# EAGLE design atmega embedded main - za drugog Marka (EAGLE 9.5.1)
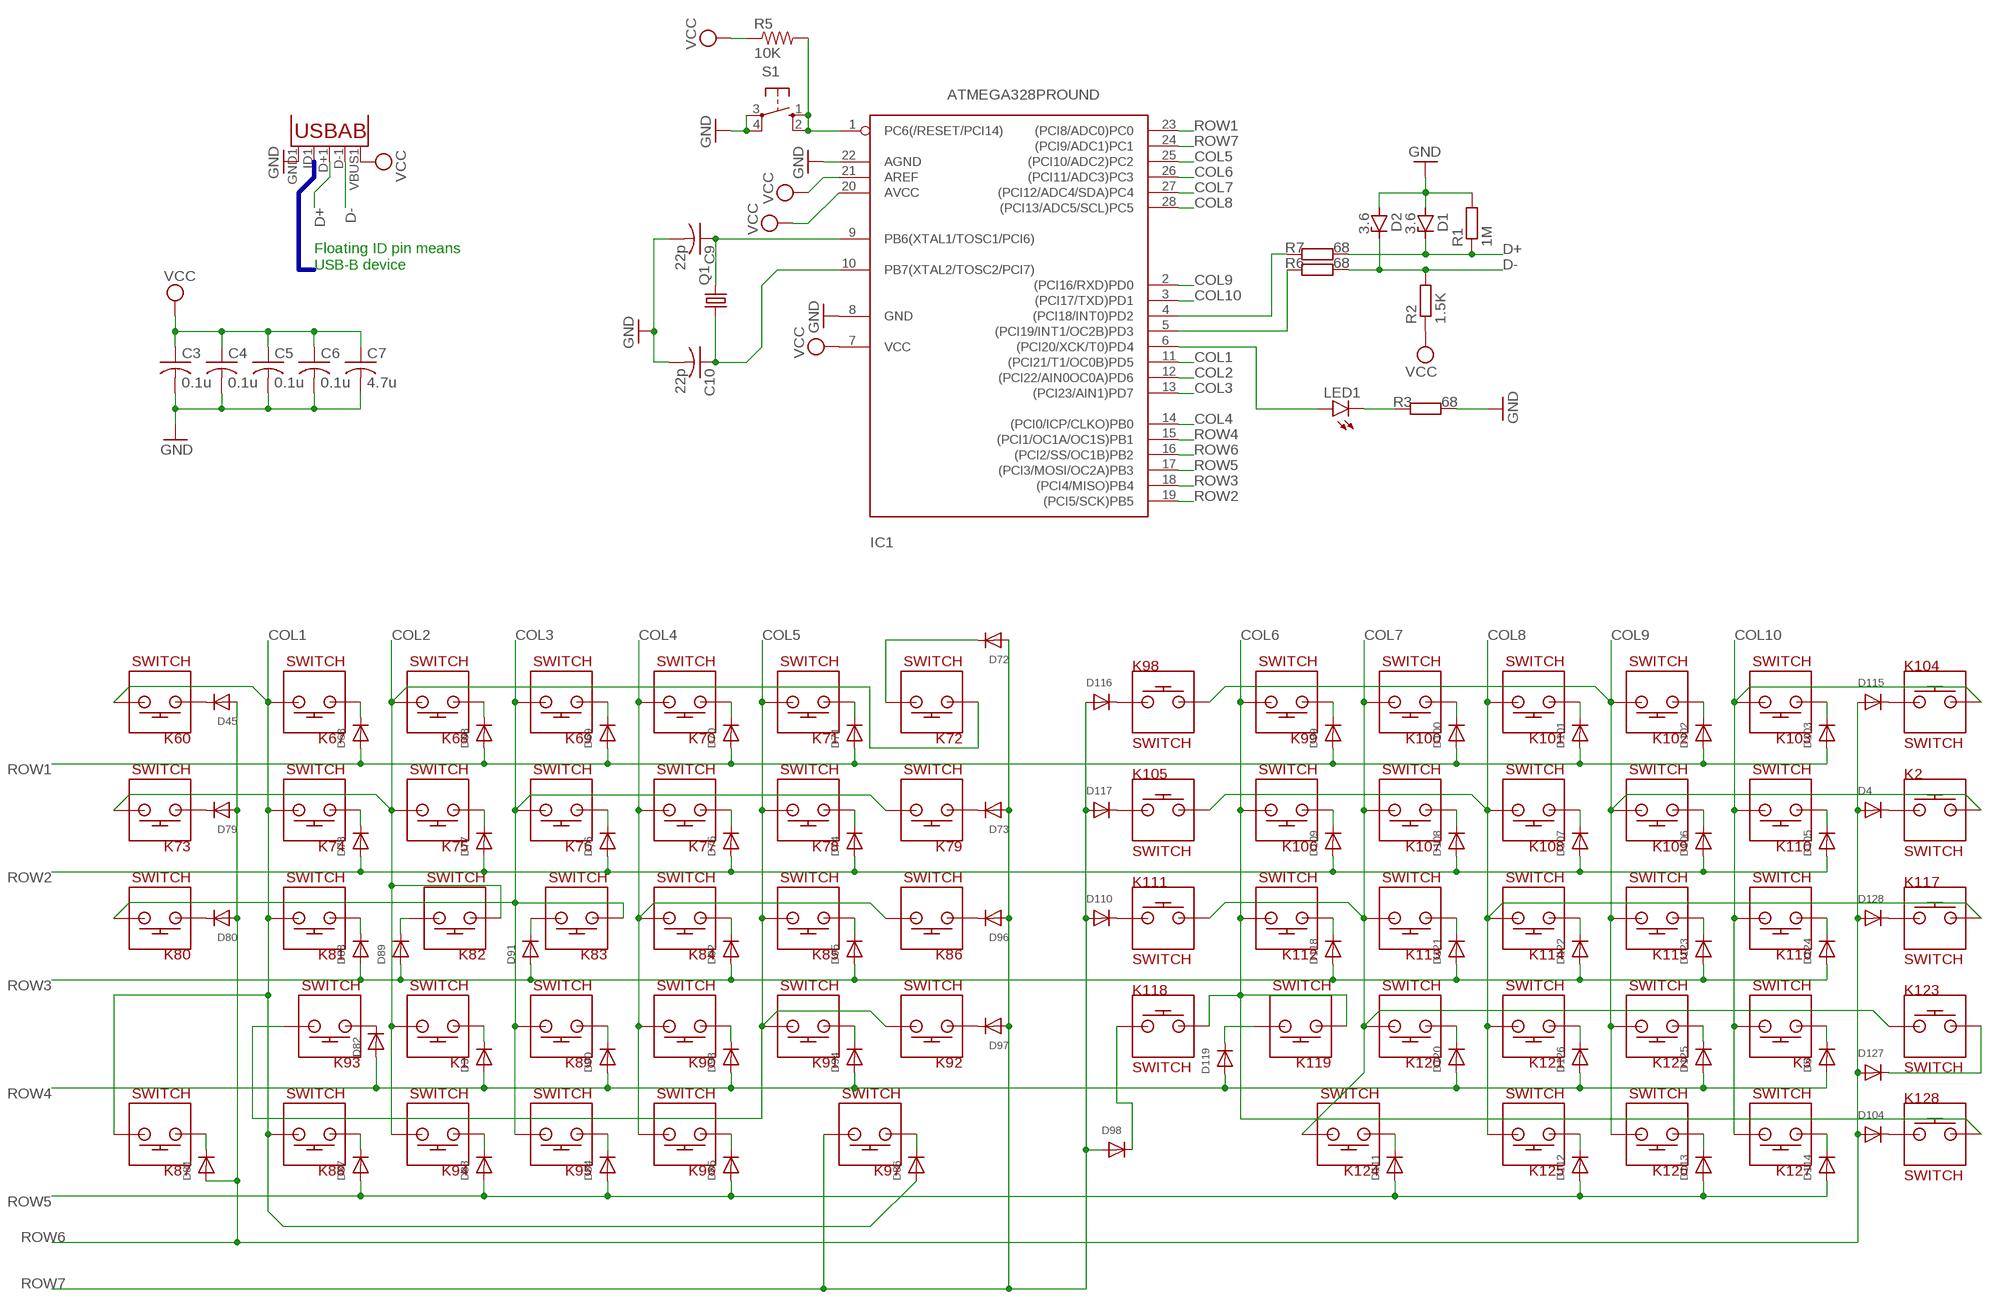
[diagram p0: schematic, sheet 1]

## Parts
C3  0.1u  C-USC0805  [C0805]
C4  0.1u  C-USC0805  [C0805]
C5  0.1u  C-USC0805  [C0805]
C6  0.1u  C-USC0805  [C0805]
C7  4.7u  C-USC0805  [C0805]
C9  22p  C-USC0805  [C0805]
C10  22p  C-USC0805  [C0805]
D1  3.6  ZENER-DIODESMB  [SMB]
D2  3.6  ZENER-DIODESMB  [SMB]
D3  DIODESMA  [SMADIODE]
D4  DIODESMA  [SMADIODE]
D5  DIODESMA  [SMADIODE]
D45  DIODESMA  [SMADIODE]
D63  DIODESMA  [SMADIODE]
D68  DIODESMA  [SMADIODE]
D69  DIODESMA  [SMADIODE]
D70  DIODESMA  [SMADIODE]
D71  DIODESMA  [SMADIODE]
D72  DIODESMA  [SMADIODE]
D73  DIODESMA  [SMADIODE]
D74  DIODESMA  [SMADIODE]
D75  DIODESMA  [SMADIODE]
D76  DIODESMA  [SMADIODE]
D77  DIODESMA  [SMADIODE]
D78  DIODESMA  [SMADIODE]
D79  DIODESMA  [SMADIODE]
D80  DIODESMA  [SMADIODE]
D81  DIODESMA  [SMADIODE]
D82  DIODESMA  [SMADIODE]
D83  DIODESMA  [SMADIODE]
D84  DIODESMA  [SMADIODE]
D85  DIODESMA  [SMADIODE]
D86  DIODESMA  [SMADIODE]
D87  DIODESMA  [SMADIODE]
D88  DIODESMA  [SMADIODE]
D89  DIODESMA  [SMADIODE]
D90  DIODESMA  [SMADIODE]
D91  DIODESMA  [SMADIODE]
D92  DIODESMA  [SMADIODE]
D93  DIODESMA  [SMADIODE]
D94  DIODESMA  [SMADIODE]
D95  DIODESMA  [SMADIODE]
D96  DIODESMA  [SMADIODE]
D97  DIODESMA  [SMADIODE]
D98  DIODESMA  [SMADIODE]
D99  DIODESMA  [SMADIODE]
D100  DIODESMA  [SMADIODE]
D101  DIODESMA  [SMADIODE]
D102  DIODESMA  [SMADIODE]
D103  DIODESMA  [SMADIODE]
D104  DIODESMA  [SMADIODE]
D105  DIODESMA  [SMADIODE]
D106  DIODESMA  [SMADIODE]
D107  DIODESMA  [SMADIODE]
D108  DIODESMA  [SMADIODE]
D109  DIODESMA  [SMADIODE]
D110  DIODESMA  [SMADIODE]
D111  DIODESMA  [SMADIODE]
D112  DIODESMA  [SMADIODE]
D113  DIODESMA  [SMADIODE]
D114  DIODESMA  [SMADIODE]
D115  DIODESMA  [SMADIODE]
D116  DIODESMA  [SMADIODE]
D117  DIODESMA  [SMADIODE]
D118  DIODESMA  [SMADIODE]
D119  DIODESMA  [SMADIODE]
D120  DIODESMA  [SMADIODE]
D121  DIODESMA  [SMADIODE]
D122  DIODESMA  [SMADIODE]
D123  DIODESMA  [SMADIODE]
D124  DIODESMA  [SMADIODE]
D125  DIODESMA  [SMADIODE]
D126  DIODESMA  [SMADIODE]
D127  DIODESMA  [SMADIODE]
D128  DIODESMA  [SMADIODE]
IC1  ATMEGA328PROUND  [DIL28-3-ROUND]
K1  SWITCH  [KAILH_LOW_PROFILE]
K2  SWITCH  [KAILH_LOW_PROFILE]
K3  SWITCH  [KAILH_LOW_PROFILE]
K60  SWITCH  [KAILH_LOW_PROFILE]
K67  SWITCH  [KAILH_LOW_PROFILE]
K68  SWITCH  [KAILH_LOW_PROFILE]
K69  SWITCH  [KAILH_LOW_PROFILE]
K70  SWITCH  [KAILH_LOW_PROFILE]
K71  SWITCH  [KAILH_LOW_PROFILE]
K72  SWITCH  [KAILH_LOW_PROFILE]
K73  SWITCH  [KAILH_LOW_PROFILE]
K74  SWITCH  [KAILH_LOW_PROFILE]
K75  SWITCH  [KAILH_LOW_PROFILE]
K76  SWITCH  [KAILH_LOW_PROFILE]
K77  SWITCH  [KAILH_LOW_PROFILE]
K78  SWITCH  [KAILH_LOW_PROFILE]
K79  SWITCH  [KAILH_LOW_PROFILE]
K80  SWITCH  [KAILH_LOW_PROFILE]
K81  SWITCH  [KAILH_LOW_PROFILE]
K82  SWITCH  [KAILH_LOW_PROFILE]
K83  SWITCH  [KAILH_LOW_PROFILE]
K84  SWITCH  [KAILH_LOW_PROFILE]
K85  SWITCH  [KAILH_LOW_PROFILE]
K86  SWITCH  [KAILH_LOW_PROFILE]
K87  SWITCH  [KAILH_LOW_PROFILE]
K88  SWITCH  [KAILH_LOW_PROFILE]
K89  SWITCH  [KAILH_LOW_PROFILE]
K90  SWITCH  [KAILH_LOW_PROFILE]
K91  SWITCH  [KAILH_LOW_PROFILE]
K92  SWITCH  [KAILH_LOW_PROFILE]
K93  SWITCH  [KAILH_LOW_PROFILE]
K94  SWITCH  [KAILH_LOW_PROFILE]
K95  SWITCH  [KAILH_LOW_PROFILE]
K96  SWITCH  [KAILH_LOW_PROFILE]
K97  SWITCH  [KAILH_LOW_PROFILE]
K98  SWITCH  [KAILH_LOW_PROFILE]
K99  SWITCH  [KAILH_LOW_PROFILE]
K100  SWITCH  [KAILH_LOW_PROFILE]
K101  SWITCH  [KAILH_LOW_PROFILE]
K102  SWITCH  [KAILH_LOW_PROFILE]
K103  SWITCH  [KAILH_LOW_PROFILE]
K104  SWITCH  [KAILH_LOW_PROFILE]
K105  SWITCH  [KAILH_LOW_PROFILE]
K106  SWITCH  [KAILH_LOW_PROFILE]
K107  SWITCH  [KAILH_LOW_PROFILE]
K108  SWITCH  [KAILH_LOW_PROFILE]
K109  SWITCH  [KAILH_LOW_PROFILE]
K110  SWITCH  [KAILH_LOW_PROFILE]
K111  SWITCH  [KAILH_LOW_PROFILE]
K112  SWITCH  [KAILH_LOW_PROFILE]
K113  SWITCH  [KAILH_LOW_PROFILE]
K114  SWITCH  [KAILH_LOW_PROFILE]
K115  SWITCH  [KAILH_LOW_PROFILE]
K116  SWITCH  [KAILH_LOW_PROFILE]
K117  SWITCH  [KAILH_LOW_PROFILE]
K118  SWITCH  [KAILH_LOW_PROFILE]
K119  SWITCH  [KAILH_LOW_PROFILE]
K120  SWITCH  [KAILH_LOW_PROFILE]
K121  SWITCH  [KAILH_LOW_PROFILE]
K122  SWITCH  [KAILH_LOW_PROFILE]
K123  SWITCH  [KAILH_LOW_PROFILE]
K124  SWITCH  [KAILH_LOW_PROFILE]
K125  SWITCH  [KAILH_LOW_PROFILE]
K126  SWITCH  [KAILH_LOW_PROFILE]
K127  SWITCH  [KAILH_LOW_PROFILE]
K128  SWITCH  [KAILH_LOW_PROFILE]
LED1  LEDCHIPLED_1206  [CHIPLED_1206]
Q1  CRYSTALHC49S  [HC49/S]
R1  1M  RR1206  [R1206]
R2  1.5K  RR1206  [R1206]
R3  68  RR1206  [R1206]
R5  10K  R-US_M0805  [M0805]
R6  68  RR1206  [R1206]
R7  68  RR1206  [R1206]
S1  10-XX  [B3F-10XX]
U1  USB""  [USB-MICRO-SMD]

## Nets
COL1: D86.A IC1.11((PCI21/T1/OC0B)PD5) K60.P$2 K67.P$2 K74.P$2 K81.P$2 K87.P$2 K88.P$2
COL2: IC1.12((PCI22/AIN0OC0A)PD6) K1.P$2 K68.P$2 K72.P$1 K73.P$2 K75.P$2 K82.P$1 K94.P$2
COL3: IC1.13((PCI23/AIN1)PD7) K69.P$2 K76.P$2 K79.P$2 K80.P$2 K83.P$1 K89.P$2 K95.P$2
COL4: IC1.14((PCI0/ICP/CLKO)PB0) K70.P$2 K77.P$2 K84.P$2 K86.P$2 K90.P$2 K96.P$2
COL5: IC1.25((PCI10/ADC2)PC2) K71.P$2 K78.P$2 K85.P$2 K91.P$2 K92.P$2 K93.P$2
COL6: IC1.26((PCI11/ADC3)PC3) K99.P$2 K106.P$2 K112.P$2 K118.P$2 K119.P$1 K128.P$2
COL7: IC1.27((PCI12/ADC4/SDA)PC4) K100.P$2 K107.P$2 K111.P$2 K113.P$2 K120.P$2 K123.P$1 K124.P$2
COL8: IC1.28((PCI13/ADC5/SCL)PC5) K101.P$2 K105.P$2 K108.P$2 K114.P$2 K117.P$2 K121.P$2 K125.P$2
COL9: IC1.2((PCI16/RXD)PD0) K2.P$2 K98.P$2 K102.P$2 K109.P$2 K115.P$2 K122.P$2 K126.P$2
COL10: IC1.3((PCI17/TXD)PD1) K3.P$2 K103.P$2 K104.P$2 K110.P$2 K116.P$2 K127.P$2
D+: D1.C R1.1 R7.2 U1.D+1(D+)
D-: D2.C R2.2 R6.2 U1.D-1(D-)
GND: C3.2 C4.2 C5.2 C6.2 C7.2 C9.2 C10.2 D1.A D2.A IC1.8(GND) IC1.22(AGND) R1.2 R3.2 S1.3(P) S1.4(P1) U1.GND1(GND)
N$1: D45.C K60.P$1
N$2: D79.C K73.P$1
N$3: D80.C K80.P$1
N$4: D81.C K87.P$1
N$5: D82.C K93.P$1
N$6: D63.C K67.P$1
N$7: D88.C K81.P$1
N$8: D78.C K74.P$1
N$9: D83.C K94.P$1
N$10: D77.C K75.P$1
N$11: D89.C K82.P$2
N$12: D68.C K68.P$1
N$13: D84.C K95.P$1
N$14: D76.C K76.P$1
N$15: D98.C K118.P$1
N$16: C9.1 IC1.9(PB6(XTAL1/TOSC1/PCI6)) Q1.2
N$17: C10.1 IC1.10(PB7(XTAL2/TOSC2/PCI7)) Q1.1
N$18: D69.C K69.P$1
N$19: D90.C K89.P$1
N$20: D85.C K96.P$1
N$21: IC1.4((PCI18/INT0)PD2) R7.1
N$22: D91.C K83.P$2
N$23: D86.C K97.P$1
N$24: D70.C K70.P$1
N$25: D75.C K77.P$1
N$26: D5.C K3.P$1
N$27: D116.C K98.P$1
N$28: D117.C K105.P$1
N$29: D92.C K84.P$1
N$30: D93.C K90.P$1
N$31: D94.C K91.P$1
N$32: D71.C K71.P$1
N$33: D74.C K78.P$1
N$34: D95.C K85.P$1
N$35: D4.C K2.P$1
N$36: D72.C K72.P$2
N$37: D73.C K79.P$1
N$38: D96.C K86.P$1
N$39: D97.C K92.P$1
N$40: D110.C K111.P$1
N$41: D119.C K119.P$2
N$42: D115.C K104.P$1
N$43: D127.C K123.P$2
N$44: D99.C K99.P$1
N$45: D109.C K106.P$1
N$46: D118.C K112.P$1
N$47: D111.C K124.P$1
N$48: D100.C K100.P$1
N$49: D108.C K107.P$1
N$50: D121.C K113.P$1
N$51: D120.C K120.P$1
N$52: D126.C K121.P$1
N$53: D101.C K101.P$1
N$54: D107.C K108.P$1
N$55: D122.C K114.P$1
N$56: D112.C K125.P$1
N$57: D123.C K115.P$1
N$58: D106.C K109.P$1
N$59: D102.C K102.P$1
N$60: D113.C K126.P$1
N$61: D124.C K116.P$1
N$62: D105.C K110.P$1
N$63: D103.C K103.P$1
N$64: D114.C K127.P$1
N$65: D128.C K117.P$1
N$67: D104.C K128.P$1
N$68: IC1.5((PCI19/INT1/OC2B)PD3) R6.1
N$69: IC1.6((PCI20/XCK/T0)PD4) LED1.A
N$70: LED1.C R3.1
N$71: D3.C K1.P$1
N$80: D87.C K88.P$1
N$142: D125.C K122.P$1
RESET: IC1.1(PC6(/RESET/PCI14)) R5.2 S1.1(S) S1.2(S1)
ROW1: D63.A D68.A D69.A D70.A D71.A D99.A D100.A D101.A D102.A D103.A IC1.23((PCI8/ADC0)PC0)
ROW2: D74.A D75.A D76.A D77.A D78.A D105.A D106.A D107.A D108.A D109.A IC1.19((PCI5/SCK)PB5)
ROW3: D88.A D89.A D91.A D92.A D95.A D118.A D121.A D122.A D123.A D124.A IC1.18((PCI4/MISO)PB4)
ROW4: D3.A D5.A D82.A D90.A D93.A D94.A D119.A D120.A D125.A D126.A IC1.15((PCI1/OC1A/OC1S)PB1)
ROW5: D83.A D84.A D85.A D87.A D111.A D112.A D113.A D114.A IC1.17((PCI3/MOSI/OC2A)PB3)
ROW6: D4.A D45.A D79.A D80.A D81.A D104.A D115.A D127.A D128.A IC1.16((PCI2/SS/OC1B)PB2)
ROW7: D72.A D73.A D96.A D97.A D98.A D110.A D116.A D117.A IC1.24((PCI9/ADC1)PC1) K97.P$2
VCC: C3.1 C4.1 C5.1 C6.1 C7.1 IC1.7(VCC) IC1.20(AVCC) IC1.21(AREF) R2.1 R5.1 U1.VBUS1(VBUS)
Unconnected: U1.ID1(USBID)

## Buses
B$1

## Notes on the sheet
- Floating ID pin means
  USB-B device

## Library data of the parts
C3-C7 C9 C10 = adafruit:C-US: CAPACITOR, American symbol
D1 D2 = diode:ZENER-DIODE: Z-Diode
D3-D5 D45 D63 D68-D128 = adafruit:DIODE: Diode SMADIODE - SMA Surface Mount Package 20V 1A Schottky Diode Digikey: 641-1014-6-ND DO-1N4148 - Through Hole Small Current Diode SOD-123 20V 1 A (.5mV Vf) Schottky Diode - Digikey: MBRX120TPMSCT-ND SOD-323 10V 570mA (.38mV Vf, 3ns) Schottky Diode - Digikey: ZLLS410CT-ND SOD-523 30V 30mA Schottky Diode (RB751S-40TE61) - Digikey: RB751S-40TE61CT-ND SOT23-R/W - SOT23 Package (R = Solder Paste/Reflow Ovens, W = Hand-Soldering) BAT54Film 40V 300mA - Digikey: 497-7162-1-ND
IC1 = atmega328:ATMEGA328*P: MICROCONTROLLER 32 kBytes FLASH 2 kBytes SRAM 1 kBytes EEPROM USART 8-channel 10 bit ADC
K1-K3 K60 K67-K128 = keyboard_switch:SWITCH
LED1 = led:LED: LED OSRAM: - CHIPLED LG R971, LG N971, LY N971, LG Q971, LY Q971, LO R971, LY R971 LH N974, LH R974 LS Q976, LO Q976, LY Q976 LO Q996 - Hyper CHIPLED LW Q18S LB Q993, LB Q99A, LB R99A - SideLED LS A670, LO A670, LY A670, LG A670, LP A670 LB A673, LV A673, LT A673, LW A673 LH A674 LY A675 LS A676, LA A676, LO A676, LY A676, LW A676 LS A679, LY A679, LG A679 - Hyper Micro SIDELED® LS Y876, LA Y876, LO Y876, LY Y876 LT Y87S - SmartLED LW L88C, LW L88S LB L89C, LB L89S, LG L890 LS L89K, LO L89K, LY L89K LS L896, LA L896, LO L896, LY L896 - TOPLED LS T670, LO T670, LY T670, LG T670, LP T670 LSG T670, LSP T670, LSY T670, LOP T670, LYG T670 LG T671, LOG T671, LSG T671 LB T673, LV T673, LT T673, LW T673 LH T674 LS T676, LA T676, LO T676, LY T676, LB T676, LH T676, LSB T676, LW T676 LB T67C, LV T67C, LT T67C, LS T67K, LO T67K, LY T67K, LW E67C LS E67B, LA E67B, LO E67B, LY E67B, LB E67C, LV E67C, LT E67C LW T67C LS T679, LY T679, LG T679 LS T770, LO T770, LY T770, LG T770, LP T770 LB T773, LV T773, LT T773, LW T773 LH T774 LS E675, LA E675, LY E675, LS T675 LS T776, LA T776, LO T776, LY T776, LB T776 LHGB T686 LT T68C, LB T68C - Hyper Mini TOPLED® LB M676 - Mini TOPLED Santana® LG M470 LS M47K, LO M47K, LY M47K Source: http://www.osram.convergy.de LUXEON: - LUMILED® LXK2-PW12-R00, LXK2-PW12-S00, LXK2-PW14-U00, LXK2-PW14-V00 LXK2-PM12-R00, LXK2-PM12-S00, LXK2-PM14-U00 LXK2-PE12-Q00, LXK2-PE12-R00, LXK2-PE12-S00, LXK2-PE14-T00, LXK2-PE14-U00 LXK2-PB12-K00, LXK2-PB12-L00, LXK2-PB12-M00, LXK2-PB14-N00, LXK2-PB14-P00, LXK2-PB14-Q00 LXK2-PR12-L00, LXK2-PR12-M00, LXK2-PR14-Q00, LXK2-PR14-R00 LXK2-PD12-Q00, LXK2-PD12-R00, LXK2-PD12-S00 LXK2-PH12-R00, LXK2-PH12-S00 LXK2-PL12-P00, LXK2-PL12-Q00, LXK2-PL12-R00 Source: www.luxeon.com KINGBRIGHT: KA-3528ASYC Source: www.kingbright.com
Q1 = crystal:CRYSTAL: CRYSTAL; OC_FARNELL: 1667008; OC_NEWARK: unknown
R1-R3 R6 R7 = eagle-ltspice:R: RESISTOR, European symbol; SPICEMODEL: NONE; SPICEPREFIX: R
R5 = adafruit:R-US_: RESISTOR, American symbol
S1 = switch-omron:10-XX: OMRON SWITCH; MPN: B3F-1000; OC_FARNELL: 176432; OC_NEWARK: 36M3542
U1 = microusb:USB: This is a USB AB connector that is compatible with USB OTG. i.e. this connector can serve as a host or device

## Net classes
0 default: width 2 mm, drill 2 mm

## Board
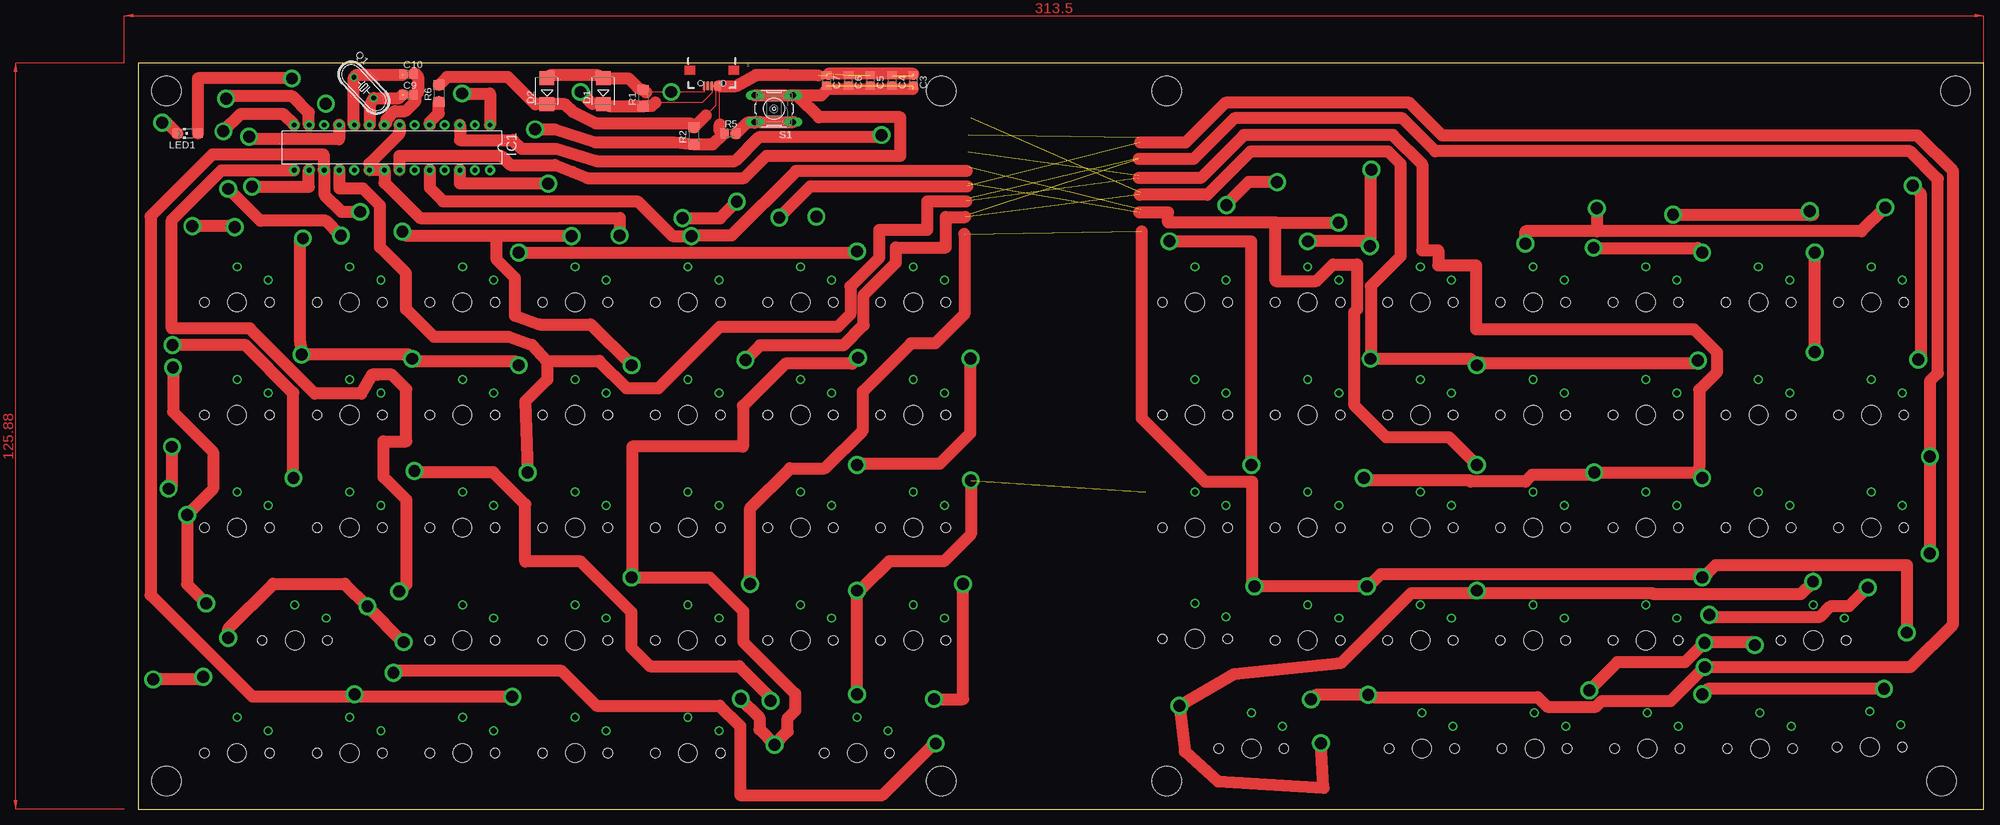
[diagram p1: board, top side]
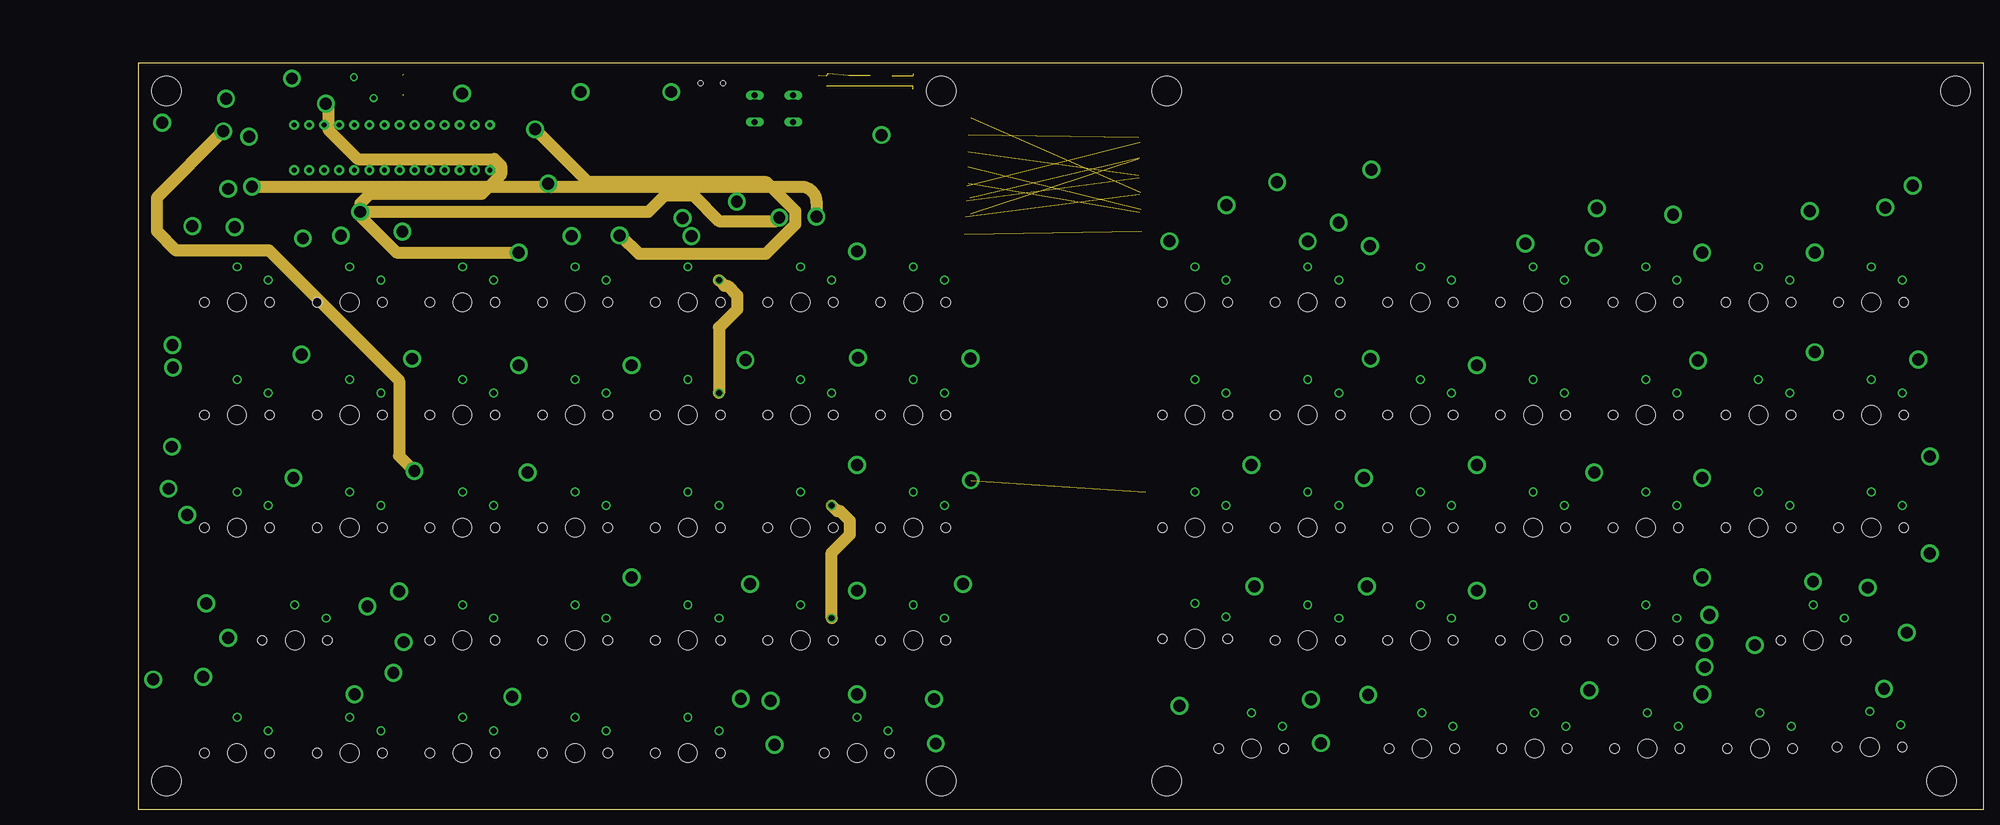
[diagram p2: board, inner layer Route7]
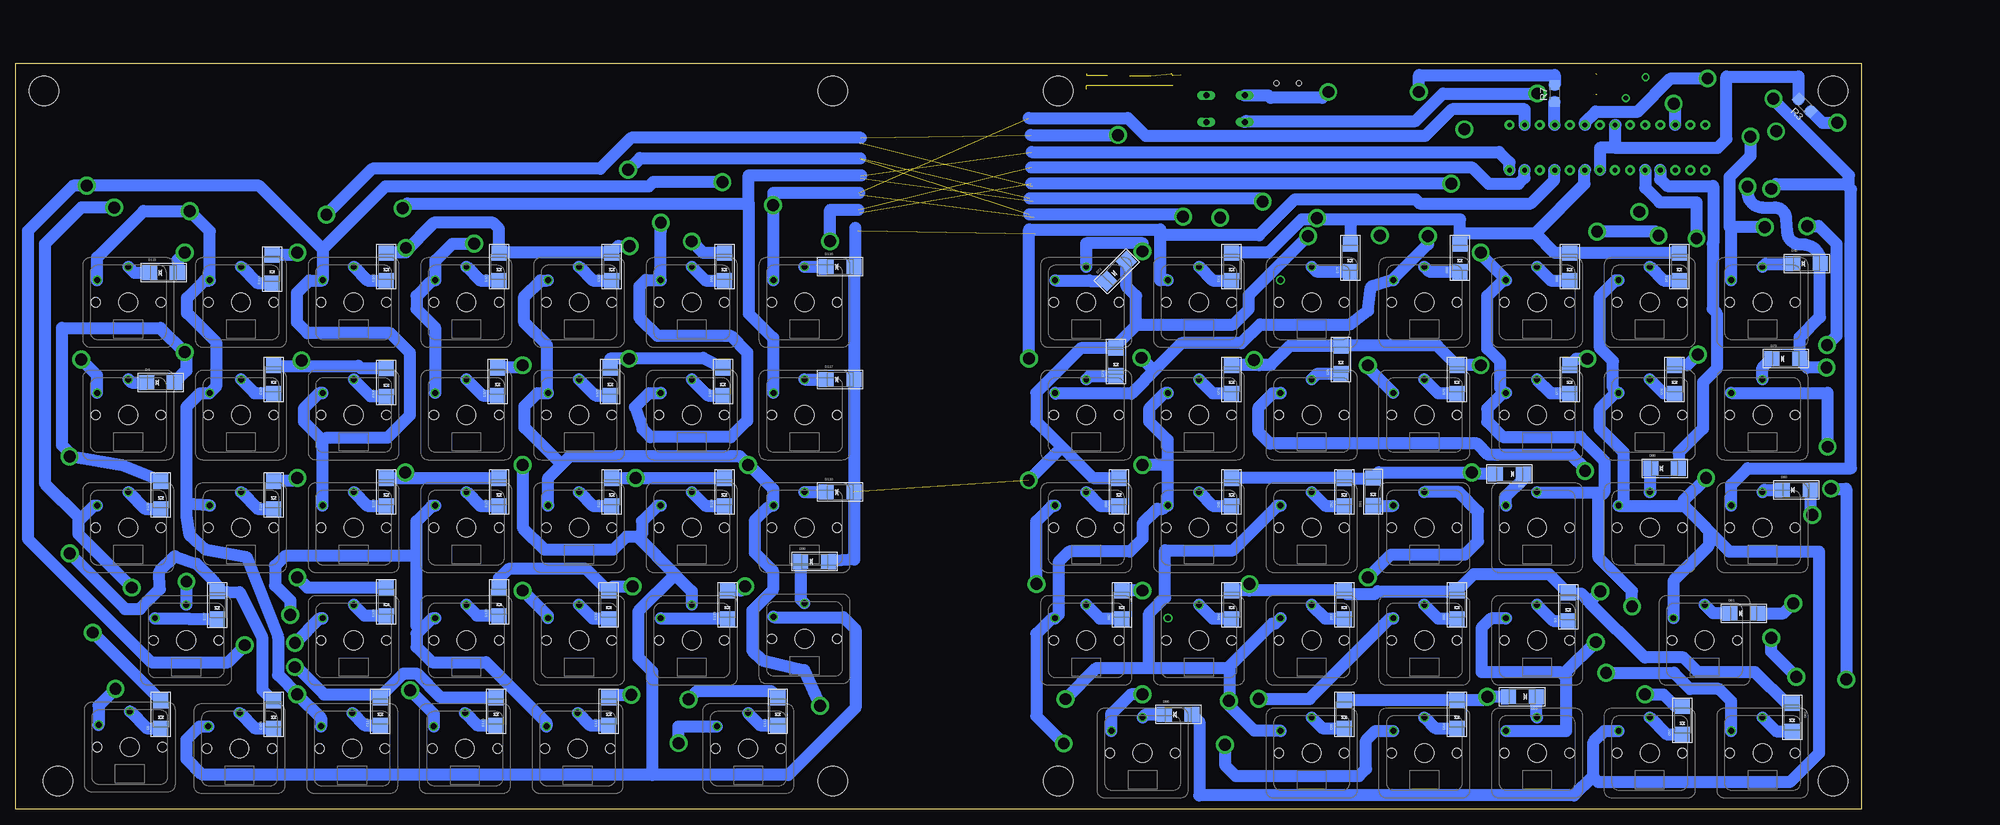
[diagram p3: board, bottom side, seen from below]

Size 311.12 x 125.88 mm. Coordinates in mm from the lower left corner, seen from the top.
Outline: 0,0 311.12,0 311.12,125.88 0,125.88 0,0
Copper layers (1*16): Top 0.035mm / dielectric 1.5mm / Bottom 0.035mm
Design rules "atmega embedded main - za drugog Marka": minimum track width 6mil, minimum drill 0.35mm, track to track 0.205mm, track to pad 0.205mm, pad to pad 0.205mm, via to via 0.205mm, smd to smd 6mil, copper to edge 40mil, drill to drill 6mil, minimum pad ring 10mil, minimum via ring 8mil, stop-mask expansion 4mil, vias tented up to drill 0mil, thermal gap 10mil
Holes 5 mm at 4.75,4.75 304,4.75 135.38,4.75 173.38,4.75 135.38,121.12 4.75,121.12 173.38,121.12 306.38,121.12
tRestrict: area 142.1,119 to 166.6,126.5; area 142.6,-1 to 166.1,95.8
bRestrict: area 142.6,0 to 166.1,96; area 142.1,119 to 166.6,126.5
vRestrict: area 142.6,-1 to 166.1,126.5; area 24.1,107.5 to 61.1,116.5; area 67.1,117.8 to 70.6,124.5; area 76.6,117.9 to 80.1,124.5; area 84.1,117.5 to 86.1,122.5; area 88.6,113 to 101.2,115; area 102.6,115.5 to 111.4,121; area 115.6,121 to 131.1,125; area 91.6,122 to 101.6,126; area 94.1,119 to 99.6,122.5; area 43.6,119.9 to 47.5,125; area 49.6,116.5 to 60.6,123; 2 more areas

### Footprints (pad centres in the part's own frame; a part is rotated, then mirrored left to right if it is on the bottom)
C0805 = smd 1.3 x 1.5: 1 -0.85,0; 2 0.85,0
SMB = smd 2.4 x 2.4: A 2.2,0; C -2.2,0
SMADIODE = smd 2.54 x 2.54: A 2.349,0; C -2.349,0
DIL28-3-ROUND = drill 0.813 pad 1.676: 1 -16.51,-3.81; 2 -13.97,-3.81; 3 -11.43,-3.81; 4 -8.89,-3.81; 5 -6.35,-3.81; 6 -3.81,-3.81; 7 -1.27,-3.81; 8 1.27,-3.81; 9 3.81,-3.81; 10 6.35,-3.81; 11 8.89,-3.81; 12 11.43,-3.81; 13 13.97,-3.81; 14 16.51,-3.81; 15 16.51,3.81; 16 13.97,3.81; 17 11.43,3.81; 18 8.89,3.81; 19 6.35,3.81; 20 3.81,3.81; 21 1.27,3.81; 22 -1.27,3.81; 23 -3.81,3.81; 24 -6.35,3.81; 25 -8.89,3.81; 26 -11.43,3.81; 27 -13.97,3.81; 28 -16.51,3.81
KAILH_LOW_PROFILE = drill 1: P$1 0,6; P$2 -5.25,3.75 | hole 1.6: -5.5,0; 5.5,0 | hole 3.2: 0,0
CHIPLED_1206 = smd 1.5 x 1.5: A 0,-1.75; C 0,1.75
HC49/S = drill 0.813: 1 -2.413,0; 2 2.413,0
R1206 = smd 1.6 x 1.803: 1 -1.422,0; 2 1.422,0
M0805 = smd 1.3 x 1.6: 1 -0.95,0; 2 0.95,0
B3F-10XX = drill 1.016 long: 1 -3.251,2.261; 2 3.251,2.261; 3 -3.251,-2.261; 4 3.251,-2.261
USB-MICRO-SMD = smd 1.4 x 0.4: D+1 2.7,0; D-1 2.7,0.65; GND1 2.7,-1.3; ID1 2.7,-0.65; VBUS1 2.7,1.3 | hole 0.85: 2.2,1.9; 2.2,-1.9

### Placement (x,y rotation side)
C3  130.62,122.91 270 top
C4  127.06,122.91 270 top
C5  123.38,122.91 270 top
C6  119.69,122.91 270 top
C7  116,122.91 270 top
C9  45.53,120.5 0 top
C10  45.53,124 0 top
D1  78.38,121.12 90 top
D2  68.88,121.12 90 top
D3  49.38,34.12 90 bottom
D4  286.69,72 0 bottom
D5  286.62,16 90 bottom
D45  9.19,92.06 0 bottom
D63  30.62,91.5 90 bottom
D68  49.12,91.5 90 bottom
D69  67.62,93 90 bottom
D70  86.12,93 90 bottom
D71  106.12,91.5 90 bottom
D72  125.5,90.75 45 bottom
D73  125.62,75.5 90 bottom
D74  106.12,72.5 90 bottom
D75  87.69,75.83 90 bottom
D76  68.12,72.5 90 bottom
D77  49.12,72.5 90 bottom
D78  31.45,72.5 90 bottom
D79  12.69,76 0 bottom
D80  10.94,53.87 0 bottom
D81  19.79,33.07 0 bottom
D82  11.62,15.5 90 bottom
D83  57.12,19 180 bottom
D84  68.12,16 90 bottom
D85  87.12,16 90 bottom
D86  115.12,16 0 bottom
D87  30.12,15 90 bottom
D88  33.12,57.5 0 bottom
D89  59.28,56.57 180 bottom
D90  68.12,34.5 90 bottom
D91  82.25,53.56 90 bottom
D92  87.12,53.5 90 bottom
D93  87.12,34.5 90 bottom
D94  106.12,34.5 90 bottom
D95  106.12,53.5 90 bottom
D96  125.12,53.5 90 bottom
D97  124.62,34.5 90 bottom
D98  176.43,41.78 0 bottom
D99  191.62,91.5 90 bottom
D100  210.62,91.5 90 bottom
D101  229.62,91.5 90 bottom
D102  248.62,91.5 90 bottom
D103  267.88,91.12 90 bottom
D104  267.62,16 90 bottom
D105  267.62,72.5 90 bottom
D106  248.62,72 90 bottom
D107  229.88,72.12 90 bottom
D108  210.88,72.12 90 bottom
D109  191.88,72.12 90 bottom
D110  172.12,53.5 0 bottom
D111  182.62,16.5 90 bottom
D112  211.12,16.5 90 bottom
D113  230.12,16.5 90 bottom
D114  249.62,16.5 90 bottom
D115  286.19,90.5 0 bottom
D116  172.12,91.5 0 bottom
D117  172.12,72.5 0 bottom
D118  191.62,53.5 90 bottom
D119  191.12,34.5 90 bottom
D120  211.12,34.5 90 bottom
D121  210.62,53.5 90 bottom
D122  229.62,53.5 90 bottom
D123  248.62,53.5 90 bottom
D124  267.62,53 90 bottom
D125  248.62,35 90 bottom
D126  229.62,35 90 bottom
D127  277.12,34.44 90 bottom
D128  286.62,53 90 bottom
IC1  42.75,111.62 180 top
K1  54.62,28.5 0 bottom
K2  292.12,66.5 0 bottom
K3  291.88,10.5 0 bottom
K60  16.62,85.5 0 bottom
K67  35.62,85.5 0 bottom
K68  54.62,85.5 0 bottom
K69  73.62,85.5 0 bottom
K70  92.62,85.5 0 bottom
K71  111.62,85.5 0 bottom
K72  130.62,85.5 0 bottom
K73  16.62,66.5 0 bottom
K74  35.62,66.5 0 bottom
K75  54.62,66.5 0 bottom
K76  73.62,66.5 0 bottom
K77  92.62,66.5 0 bottom
K78  111.62,66.5 0 bottom
K79  130.62,66.5 0 bottom
K80  16.62,47.5 0 bottom
K81  35.62,47.5 0 bottom
K82  54.62,47.5 0 bottom
K83  73.62,47.5 0 bottom
K84  92.62,47.5 0 bottom
K85  111.62,47.5 0 bottom
K86  130.62,47.5 0 bottom
K87  26.38,28.5 0 bottom
K88  35.62,9.5 0 bottom
K89  73.62,28.5 0 bottom
K90  92.62,28.5 0 bottom
K91  111.62,28.5 0 bottom
K92  130.62,28.5 0 bottom
K93  16.62,9.5 0 bottom
K94  54.62,9.5 0 bottom
K95  73.62,9.5 0 bottom
K96  92.62,9.5 0 bottom
K97  121.12,9.5 0 bottom
K98  178.12,85.5 0 bottom
K99  197.12,85.5 0 bottom
K100  216.12,85.5 0 bottom
K101  235.12,85.5 0 bottom
K102  254.12,85.5 0 bottom
K103  273.12,85.5 0 bottom
K104  292.12,85.5 0 bottom
K105  178.12,66.5 0 bottom
K106  197.12,66.5 0 bottom
K107  216.12,66.5 0 bottom
K108  235.12,66.5 0 bottom
K109  254.12,66.5 0 bottom
K110  273.12,66.5 0 bottom
K111  178.12,47.5 0 bottom
K112  197.12,47.5 0 bottom
K113  216.12,47.5 0 bottom
K114  235.12,47.5 0 bottom
K115  254.12,47.5 0 bottom
K116  273.12,47.5 0 bottom
K117  292.12,47.5 0 bottom
K118  178.12,28.75 0 bottom
K119  197.12,28.5 0 bottom
K120  216.12,28.5 0 bottom
K121  235.12,28.5 0 bottom
K122  254.12,28.5 0 bottom
K123  282.38,28.5 0 bottom
K124  187.62,10.25 0 bottom
K125  216.38,10.25 0 bottom
K126  235.38,10.25 0 bottom
K127  254.38,10.25 0 bottom
K128  273.38,10.25 0 bottom
LED1  8.31,114 90 top
Q1  38,121.72 313.5 top
R1  85.12,119.94 90 top
R2  93.62,113.58 90 top
R3  9.5,118.75 135 bottom
R5  99.79,114 0 top
R6  50.69,120.75 90 top
R7  51.66,120.75 90 bottom
S1  107.14,118.16 180 top
U1  96.67,124.69 270 top

### Tracks (layer width: path | path; a pad name or v marks a point on that pad's centre or on a via)
COL1  (via drill 2)
  Top 2: v18.64,113.47 19.09,113.02 33.83,113.02 33.83,115.4 IC1.11 | v16.23,98.2 16.05,98.38 v9.1,98.38 | v5.72,78.3 5.75,78.28 18.09,78.28 26.12,70.25 v26.12,55.9
  Bottom 2: D86.A 111.58,14.8 111.58,2.35 48.38,2.35 45.23,5.51 | 45.23,5.51 45.12,5.61 45.12,11.36 43.28,13.2 40.92,13.2 K88.P$2 | 21.93,98.2 21.93,89.3 K60.P$2 | K87.P$2 31.62,38.53 25.68,44.47 25.68,46.96 | 29.82,51.2 26.23,47.61 26.23,47.51 25.68,46.96 | 40.02,51.2 40.83,51.2 K81.P$2 | 40.02,51.2 29.82,51.2 | 41.42,70.2 40.92,70.2 K74.P$2 | 41.42,70.2 44.02,67.6 44.02,64.22 40.02,60.22 40.02,51.2 | K67.P$2 40.92,89.2 41.42,89.2 44.02,86.6 44.02,77.8 41.83,75.6 41.83,71.1 41.42,70.2 | v16.23,98.2 21.93,98.2 | 21.93,98.2 22.16,98.2 22.16,106.67 18.64,110.19 v18.64,113.47 | v9.1,98.38 7.16,98.38 4.12,95.35 4.12,79.9 v5.72,78.3 | v26.12,55.9 29.93,52.1 29.82,51.2 | 45.23,5.51 44.31,4.6 12.03,4.6 7.12,9.5 7.12,43.5 22.23,43.5 25.68,46.96
COL2  (via drill 2)
  Top 2: v121.12,94.1 120.92,93.9 v64.12,93.9 | v44.73,28.2 44.63,28.2 v38.61,34.23 34.77,38.06 22.7,38.06 15.14,30.5 v15.14,28.93 | v5.63,61.17 5.63,54.63 v5.08,54.07 | v10.9,22.36 10.45,21.9 v2.52,21.9
  Route7 2: v31.59,119 32,118.6 32,114.66 36.98,109.68 60.03,109.68 61.12,108.59 61.12,107.04 57.88,103.8 39.02,103.8 37.43,102.21 37.43,99.97 43.5,93.9 v64.12,93.9
  Bottom 2: 49.76,23.17 49.76,13.2 59.83,13.2 K94.P$2 | K1.P$2 59.92,32.2 62.38,32.2 63.99,30.58 63.99,23.18 50.7,23.18 50.23,22.7 49.76,23.17 | 43.28,53.46 44.27,52.48 44.27,42.47 38.61,36.81 v38.61,34.23 | 43.28,53.46 43.28,58.79 47.31,62.82 60.45,62.82 63.02,65.4 63.02,67.6 60.42,70.2 | 60.42,70.2 59.92,70.2 K75.P$2 | 60.33,89.2 60.42,89.2 63.02,86.6 63.02,77.7 60.83,75.5 60.83,71.1 60.42,70.2 | 60.33,89.2 59.92,89.2 K68.P$2 | K72.P$1 130.62,95.5 121.12,95.5 v121.12,94.1 | v64.12,93.9 64.12,93.59 60.33,89.79 60.33,89.2 | v44.73,28.2 49.76,23.17 | K82.P$1 54.59,53.46 43.28,53.46 | v5.63,61.17 5.63,70.25 K73.P$2 | v5.08,54.07 2.52,54.07 v2.52,21.9 | v10.9,22.36 15.14,26.6 v15.14,28.93 | IC1.12 31.32,118.72 v31.59,119
COL3  (via drill 2)
  Top 2: v14.77,119.86 15.15,120.25 25.98,120.25 28.73,117.5 28.73,115.5 IC1.13 | v83.12,74.9 76.22,81.8 67.63,81.8 63.51,83.24 63.51,89.63 60.3,92.83 60.3,96.59 | 60.3,96.59 60.3,96.7 45.26,96.7 v44.51,97.45 | v73.03,96.7 60.55,96.7 60.55,96.59 60.3,96.59 | v121.33,76.16 120.33,75.17 109.06,75.17 101.92,68.03 101.92,61.19 83.25,61.19 83.25,39.2 v83.12,39.1 96.33,39.1 101.96,33.47 101.96,28.27 110.73,19.5 110.73,16.66 109.45,15.38 109.45,13.12 v107.23,10.91 104.67,13.47 104.67,15.51 v101.55,18.64 | v15.15,104.65 20.55,99.26 31.62,99.26 v34.12,96.76
  Bottom 2: v14.77,119.86 14.77,119.66 2.04,106.93 2.04,104.91 | 2.04,104.91 2.59,105.47 14.34,105.47 v15.15,104.65 | 2.04,104.91 1.72,104.6 1.72,57.5 19.12,57.5 21.88,54.75 K80.P$2 | v101.55,18.64 92.98,18.64 79.42,32.2 78.92,32.2 K89.P$2 | v83.12,39.1 79.25,42.97 66.81,42.97 64.56,45.21 64.56,50.27 67.8,53.5 K83.P$1 | v83.12,74.9 83.12,74.5 K76.P$2 | v73.03,96.7 73.03,95.3 78.83,89.5 78.83,89.37 | 78.83,89.37 78.83,89.3 K69.P$2 | 118.61,74.59 114.59,78.61 104.47,78.61 101.28,81.8 86.14,81.8 83.11,84.09 82.61,88.16 78.83,89.37 | 118.61,74.59 119.19,74.02 v121.33,76.16 | K79.P$2 135.75,70.13 123.03,70.13 118.59,74.57 118.61,74.59 | v34.12,96.76 34.12,96.87 34.75,97.49 44.47,97.49 v44.51,97.45 | v107.23,10.91 107.23,7.44 105.45,5.66 84.64,5.66 83.47,6.83 83.47,11.62 81.84,13.25 K95.P$2
COL4  (via drill 2)
  Top 2: v46.52,57.06 46.76,56.82 59.84,56.82 65.22,51.43 65.22,41.8 74.56,41.8 83.08,33.27 83.08,27.3 86.23,24.15 101.27,24.15 106.58,18.84 v106.58,18.31 | v139.03,38 139.03,18.6 v134.12,18.6 | IC1.14 24.39,117.28 17.24,117.28 v14.32,114.35
  Route7 2: v46.52,57.06 43.94,59.63 43.94,72.36 22.04,94.27 6.36,94.27 3.12,97.5 3.12,103.16 v14.32,114.35 | K70.P$2 98.81,88.32 99.29,88.32 100.94,86.67 100.94,84.33 97.88,81.27 K77.P$2
  Bottom 2: 106.45,18.31 106.45,17.43 102.33,13.3 97.92,13.3 K96.P$2 | 120.03,23.84 120.03,23.83 106.45,23.83 106.45,23.72 | 120.03,23.84 120.03,33.02 117.33,35.71 117.33,43.71 105.92,43.71 98.42,51.2 97.92,51.2 K84.P$2 | 106.45,23.72 106.83,23.72 106.83,23.77 99.29,31.32 98.81,31.32 K90.P$2 | v46.52,57.06 46.52,57.49 48.83,59.8 62.82,59.8 64.7,61.67 99.65,61.67 101.58,63.61 101.58,67.8 99.19,70.2 97.83,70.2 K77.P$2 | v106.58,18.31 106.45,18.31 | v139.03,38 139.03,48.6 136.43,51.2 135.93,51.2 K86.P$2 | v134.12,18.6 128.88,23.84 120.03,23.84 | 106.45,23.72 106.45,18.31
COL5  (via drill 2)
  Top 2: v121.12,58.1 121.33,58.3 135.12,58.3 140.26,63.44 v140.26,76.03 | v42.98,23.04 43.27,23.33 71.38,23.33 77.2,17.5 98,17.5 101.44,14.06 101.44,2.38 125.42,2.38 134.13,11.1 v134.42,11.1
  Route7 2: K91.P$2 116.88,43.27 119.94,46.33 119.94,48.67 118.29,50.32 117.81,50.32 K85.P$2
  Bottom 2: IC1.25 51.73,107.8 51.73,106.14 55.69,102.18 74.41,102.18 75.12,102.9 95.43,102.9 101.5,96.83 118.16,96.83 | 116.92,58.1 116.92,62.3 120.03,65.4 120.03,67.6 117.42,70.2 116.92,70.2 K78.P$2 | 116.92,58.1 116.92,51.3 | 116.92,51.3 K85.P$2 | v42.98,23.04 31.57,23.04 28.84,20.32 23.95,20.32 21.88,18.25 K93.P$2 | 116.92,51.3 117.72,50.7 118.62,50.7 121.12,48.2 121.12,45.65 123.3,43.48 133.5,43.48 135.28,41.7 135.28,32.84 K92.P$2 135.93,32.2 136.43,32.2 139.03,29.6 139.03,15.71 v134.42,11.1 | v140.26,76.03 140.26,97.8 118.16,97.8 118.16,96.83 | 116.92,58.1 v121.12,58.1 | K71.P$2 118.16,89.25 118.16,96.83
COL6  (via drill 2)  (1 unrouted)
  Top 2: v69.09,105.53 54.23,105.53 54.23,107.8 IC1.26 | v225.62,58.1 220.93,62.8 210.32,62.8 204.93,68.2 204.93,83.8 205.46,84.33 205.46,91.9 201.38,91.9 198.6,89.12 191.72,89.12 191.72,98.9 | v202.34,98.97 202.26,98.9 191.72,98.9 | 191.72,98.9 191.72,98.98 173.57,98.98 173.57,100.66 168.75,100.66
  Bottom 2: K119.P$1 197.12,36.77 199.93,39.58 | 206.38,46.02 199.93,39.58 | K112.P$2 202.43,51.2 202.93,51.2 205.53,48.6 205.53,46.4 206.38,46.02 | K128.P$2 280.12,14 282.31,11.81 282.31,8.51 279.65,5.86 203.81,5.86 | 203.81,5.86 203.81,23.27 206.15,25.61 206.15,33.36 199.93,39.58 | 203.81,5.86 203.81,5.8 180.82,5.8 169.54,17.09 169.54,30.37 171.56,32.39 183.26,32.39 K118.P$2 | K106.P$2 202.43,70.2 204.35,70.2 206.7,67.86 205.46,64.17 204.09,62.8 190.59,62.8 187.81,65.58 187.81,77.08 190.62,79.9 202.91,79.9 205.99,82.97 205.99,88.18 204.88,89.28 202.41,89.28 K99.P$2 202.38,97.56 | 202.38,97.56 202.34,97.6 v202.34,98.97 | 202.38,97.56 202.4,97.53 | v225.62,58.1 225.62,47.5 221.93,43.8 210.32,43.8 208.12,46 206.43,46 206.38,46.02 | v69.09,105.53 139.92,105.53
COL7  (via drill 2)  (1 unrouted)
  Top 2: v282.32,38.4 280.23,36.3 255.43,36.3 255.22,36.5 226.53,36.5 v225.62,36.9 225.22,36.5 214.62,36.5 202.85,24.73 184.78,22.83 v175.5,17.46 176.41,9.79 182.01,4.7 199.78,3.61 v199.34,11.17 | v173.79,95.81 187.62,95.81 v187.62,58.1
  Bottom 2: 183.43,51.3 183.43,54.02 187.5,58.1 v187.62,58.1 187.62,58.15 189.06,59.59 217.65,59.59 219.1,58.13 | 219.1,58.13 221.32,55.91 221.32,51.3 K113.P$2 | 183.43,51.3 K111.P$2 | K124.P$2 199.35,14 v199.34,11.17 | 183.43,51.3 184.32,50.9 186.53,48.7 186.53,43.31 183.46,40.24 183.46,36.99 186.94,33.51 186.94,26.86 185.21,25.13 178.19,23.45 v175.5,17.46 | v225.62,36.9 221.43,32.7 221.43,32.3 K120.P$2 | 221.53,70.2 223.16,70.2 225.34,68.02 225.34,64.37 219.1,58.13 | 221.53,70.2 221.43,70.2 K107.P$2 | 221.53,70.2 221.53,78.27 225.35,82.1 225.35,86.49 222.65,89.2 221.43,89.2 K100.P$2 | v282.32,38.4 282.32,34.5 K123.P$1 | 139.88,108.31 65.62,108.31 62.81,105.5 57.77,105.5 56.73,106.54 IC1.27 | v173.79,95.81 173.79,101.11 169.06,101.11
COL8  (via drill 2)  (1 unrouted)
  Top 2: v291.52,37.4 288.43,34.3 285.32,34.3 283.52,32.5 265.12,32.5 v264.81,32.8 | v233.82,95.4 233.82,97.5 245.88,97.5 | v294.5,101.51 290.49,97.5 245.88,97.5 | v245.88,101.37 245.88,97.5
  Bottom 2: K125.P$2 221.62,14.6 231.82,24.8 240.93,24.8 243.53,27.4 243.53,29.6 242.82,30.3 | 242.82,30.3 240.93,32.2 240.43,32.2 K121.P$2 | 243.53,42.73 243.53,31 242.82,30.3 | 243.53,42.73 243.53,48.6 240.93,51.2 240.43,51.2 K114.P$2 | 300.17,48.96 300.5,48.62 300.5,46.38 v291.52,37.4 | v264.81,32.8 264.81,35.21 267.38,37.77 267.38,41.07 265.71,42.73 243.53,42.73 | K117.P$2 297.43,51.2 297.93,51.2 300.17,48.96 | 187.54,102.18 187.54,83.61 183.43,79.49 183.43,70.3 K105.P$2 | v233.82,95.4 237.49,95.4 240.32,92.56 240.32,89.3 | 240.32,89.3 K101.P$2 | K108.P$2 240.43,70.3 240.43,81.3 243.53,84.4 243.53,86.6 241.22,88.9 240.32,89.3 | IC1.28 59.26,109.08 61.05,110.88 139.84,110.88 | 300.17,48.96 306.19,54.98 306.19,95.36 300.04,101.51 v294.5,101.51 | v245.88,101.37 245.07,102.18 187.54,102.18 | 168.56,106.89 187.54,106.89 187.54,102.18
COL9  (via drill 2)  (1 unrouted)
  Top 2: v244.62,20.1 249.32,24.8 260.73,24.8 v264.02,28.1 264.06,28.13 272.1,28.13 v272.52,27.7 | v300.05,75.87 300.44,76.26 300.44,103.87 v299.12,105.19 | v191.97,105.8 187.15,105.8 183.41,102.06 v183.41,101.92
  Bottom 2: K126.P$2 240.62,16.1 v244.62,20.1 | v264.02,28.1 259.93,32.2 259.43,32.2 K122.P$2 | 259.43,62.3 259.43,51.3 K115.P$2 | 259.43,62.3 262.52,65.4 262.52,67.6 259.93,70.2 259.43,70.2 K109.P$2 | 259.43,62.3 258.52,62.7 248.43,62.7 244.63,66.49 244.63,77 247.96,80.32 261.89,80.32 263.69,82.11 263.69,87.14 261.62,89.2 259.43,89.2 K102.P$2 259.38,94.47 | IC1.2 56.72,118.08 68.97,118.08 73.5,113.54 120.58,113.54 123.61,116.57 140.34,116.57 | v272.52,27.7 272.52,27.6 275.32,24.8 288.23,24.8 309.06,45.64 309.06,97.56 301.44,105.19 v299.12,105.19 270.1,105.19 259.38,94.47 | K2.P$2 297.38,73.19 v300.05,75.87 | 183.38,101.92 183.38,104 168.91,104 | K98.P$2 183.38,101.92 | 183.38,101.92 v183.41,101.92 | v191.97,105.8 203.65,105.8 204.36,105.08 248.76,105.08 259.38,94.47
COL10  (via drill 2)  (1 unrouted)
  Top 2: v263.64,19.41 264.55,20.31 v294.29,20.31 | v125.25,113.73 124.88,113.35 104.56,113.35 100.55,109.34 77.19,109.34 70.32,111.4 64.62,111.4 63.12,112.89 54.23,112.89 54.23,115.4 IC1.3 | v258.73,100.3 282.36,100.3 v281.75,100.9
  Bottom 2: K127.P$2 259.62,15.4 v263.64,19.41 | v263.64,19.41 266.88,22.65 266.88,29.08 272.17,42.48 279.07,43.78 281.85,46.29 282.36,49.46 282.36,51.5 | 278.43,51.2 K116.P$2 282.36,51.5 | K3.P$2 297.12,17.47 v294.29,20.31 | v263.64,19.41 | 139.96,113.73 v125.25,113.73 | K104.P$2 297.38,93.06 289.54,100.9 v281.75,100.9 278.38,97.52 K103.P$2 278.43,89.2 279.27,89.2 282.2,86.27 282.2,83.67 277.32,78.79 277.32,71.3 K110.P$2 278.43,70.2 280,70.2 282.36,67.84 282.36,51.5 | v258.73,100.3 251,108.03 212.54,108.03 207.32,113.25 168.63,113.25
D+  (via drill 2)
  Top 0.152: U1.D+1 96.67,120.84 95,119.18 87.12,119.18
  Top 2: 87.12,119.18 87.12,119.2 86.53,118.6 85.12,118.6 R1.1 84.22,118.6 79.33,118.6 D1.C 78.33,119 76.53,119 v74.53,121
  Bottom 2: R7.2 51.66,123.83 74.53,123.83 v74.53,121
D-
  Top 0.152: U1.D-1 97.32,118.7 95.62,117
  Top 2: R6.2 52.02,123.5 62.33,123.5 66.9,118.92 D2.C 71.95,118.92 73.25,117.62 77.16,115.72 93,115.72 93.62,115.1 R2.2 95.62,117
GND  (via drill 2)  (5 unrouted)
  Top 0.152: U1.GND1 95.37,120.92 89.83,120.92 85.64,120.92
  Top 2: S1.4 103.92,120.4 110.33,120.4 S1.3 | 85.64,120.92 85.62,120.9 85.53,120.9 85.12,121.3 R1.2 84.22,121.7 82.62,123.3 78.42,123.3 D1.A 77.53,123.8 69.33,123.8 68.92,123.4 D2.A | v89.83,121 89.83,120.92 89.83,120.9 | S1.3 111.33,120.1 114.72,116.7 128.44,116.7 128.44,110.22 105.86,110.22 102.14,106.5 75.64,106.5 73.12,107.49 70.18,108.66 62.69,108.66 61.12,110.22 44.02,110.22 IC1.22 | S1.3 115.16,120.42 116.26,121.52 130.57,121.48 | C10.2 46.74,124 47.14,123.6 47.14,120.89 46.75,120.5 | 46.75,120.5 C9.2 | IC1.8 41.81,115.77 41.81,116.35 43.23,117.76 45.05,117.76 46.73,119.45 46.73,120.48 46.75,120.5
  Bottom 2: v89.83,121 90.83,120 99.53,120 99.92,120.4 103.83,120.4 S1.4 | IC1.8 41.42,115.4 41.42,111.58 | 41.42,111.58 44.02,111.58 IC1.22 | 41.42,111.58 24.18,111.58 22.71,113.04 22.71,123.59 10.51,123.59 R3.2
N$1
  Bottom 2: K60.P$1 16.12,92 11.62,92 D45.C
N$2
  Bottom 2: K73.P$1 16.62,74.5 15.12,76 D79.C
N$3
  Bottom 2: K80.P$1 16.26,53.87 D80.C
N$4
  Bottom 2: D81.C 24.95,33.07 K87.P$1
N$5
  Bottom 2: K93.P$1 14.32,13.2 11.62,13.2 D82.C
N$6
  Bottom 2: K67.P$1 33.33,89.2 30.62,89.2 D63.C
N$7
  Bottom 2: K81.P$1 35.52,53.6 35.52,57.5 D88.C
N$8
  Bottom 2: K74.P$1 33.33,70.2 31.45,70.2 D78.C
N$9
  Bottom 2: K94.P$1 54.73,15.6 54.73,19 D83.C
N$10
  Bottom 2: K75.P$1 52.33,70.2 49.12,70.2 D77.C
N$11
  Bottom 2: K82.P$2 59.88,52.82 56.94,55.76 D89.C
N$12
  Bottom 2: K68.P$1 52.33,89.2 49.12,89.2 D68.C
N$13
  Bottom 2: K95.P$1 71.83,13.7 68.12,13.7 D84.C
N$14
  Bottom 2: K76.P$1 71.33,70.2 68.12,70.2 D76.C
N$15
  Bottom 2: D98.C 178.77,35.4 K118.P$1
N$16  (1 unrouted)
  Top 2: IC1.9 39.02,115.5 39.02,118.76 Q1.2 43.99,119.97 44.53,120.5
N$17  (1 unrouted)
  Top 2: IC1.10 36.33,115.5 36.33,123.4 Q1.1 36.73,123.86 44.53,123.86
N$18
  Bottom 2: K69.P$1 72.83,90.7 67.62,90.7 D69.C
N$19
  Bottom 2: K89.P$1 71.33,32.2 68.12,32.2 D90.C
N$20
  Bottom 2: K96.P$1 90.83,13.7 87.12,13.7 D85.C
N$21
  Bottom 2: R7.1 51.73,119.26 51.73,115.5 IC1.4
N$22
  Bottom 2: K83.P$2 78.92,51.21 D91.C
N$23
  Bottom 2: D86.C 120.62,16 K97.P$1
N$24
  Bottom 2: K70.P$1 91.83,90.7 86.12,90.7 D70.C
N$25
  Bottom 2: K77.P$1 91.64,73.48 D75.C
N$26
  Bottom 2: D5.C 286.62,13.7 289.02,13.7 291.82,16.5 K3.P$1
N$27
  Bottom 2: K98.P$1 D116.C
N$28
  Bottom 2: K105.P$1 D117.C
N$29
  Bottom 2: K84.P$1 90.33,51.2 87.12,51.2 D92.C
N$30
  Bottom 2: K90.P$1 90.33,32.2 87.12,32.2 D93.C
N$31
  Bottom 2: K91.P$1 109.33,32.2 106.12,32.2 D94.C
N$32
  Bottom 2: K71.P$1 109.33,89.2 106.12,89.2 D71.C
N$33
  Bottom 2: K78.P$1 109.33,70.2 106.12,70.2 D74.C
N$34
  Bottom 2: K85.P$1 109.33,51.2 106.12,51.2 D95.C
N$35
  Bottom 2: D4.C 291.62,72 K2.P$1
N$36
  Bottom 2: D72.C 127.22,89.1 130.03,89.1 130.12,89.2 135.82,89.2 K72.P$2
N$37
  Bottom 2: K79.P$1 130.03,73.1 125.62,73.1 D73.C
N$38
  Bottom 2: K86.P$1 128.32,51.2 125.12,51.2 D96.C
N$39
  Bottom 2: K92.P$1 128.32,32.2 124.62,32.2 D97.C
N$40
  Bottom 2: K111.P$1 D110.C
N$41
  Bottom 2: D119.C 191.12,32.2 202.32,32.2 K119.P$2
N$42
  Bottom 2: D115.C 291.12,90.5 K104.P$1
N$43
  Bottom 2: D127.C 281.82,32.1 281.93,32.2 287.62,32.2 K123.P$2
N$44
  Bottom 2: K99.P$1 194.82,89.2 191.62,89.2 D99.C
N$45
  Bottom 2: K106.P$1 194.43,69.8 191.93,69.8 D109.C
N$46
  Bottom 2: K112.P$1 194.82,51.2 191.62,51.2 D118.C
N$47
  Bottom 2: D111.C 182.62,14.2 185.62,14.2 187.62,16.2 K124.P$1
N$48
  Bottom 2: K100.P$1 213.82,89.2 210.62,89.2 D100.C
N$49
  Bottom 2: K107.P$1 213.43,69.8 210.93,69.8 D108.C
N$50
  Bottom 2: K113.P$1 213.82,51.2 210.62,51.2 D121.C
N$51
  Bottom 2: K120.P$1 213.82,32.2 211.12,32.2 D120.C
N$52
  Bottom 2: K121.P$1 233.32,32.7 229.62,32.7 D126.C
N$53
  Bottom 2: K101.P$1 232.82,89.2 229.62,89.2 D101.C
N$54
  Bottom 2: K108.P$1 232.43,69.8 229.93,69.8 D107.C
N$55
  Bottom 2: K114.P$1 232.82,51.2 229.62,51.2 D122.C
N$56
  Bottom 2: K125.P$1 214.32,14.2 211.12,14.2 D112.C
N$57
  Bottom 2: K115.P$1 251.82,51.2 248.62,51.2 D123.C
N$58
  Bottom 2: K109.P$1 251.32,69.7 248.62,69.7 D106.C
N$59
  Bottom 2: K102.P$1 251.82,89.2 248.62,89.2 D102.C
N$60
  Bottom 2: K126.P$1 233.32,14.2 230.12,14.2 D113.C
N$61
  Bottom 2: K116.P$1 270.32,50.7 267.62,50.7 D124.C
N$62
  Bottom 2: K110.P$1 270.82,70.2 267.62,70.2 D105.C
N$63
  Bottom 2: K103.P$1 270.43,88.8 267.93,88.8 D103.C
N$64
  Bottom 2: K127.P$1 252.32,14.2 249.62,14.2 D114.C
N$65
  Bottom 2: K117.P$1 289.32,50.7 286.62,50.7 D128.C
N$67
  Bottom 2: K128.P$1 270.82,13.7 267.62,13.7 D104.C
N$68
  Top 2: R6.1 50.62,119.3 50.62,117.4 49.12,115.9 49.12,115.5 IC1.5
N$69  (via drill 2)
  Top 2: LED1.A 10.06,123.28 v25.88,123.28
  Bottom 2: IC1.6 46.52,115.5 46.52,115.9 44.73,117.7 37.62,117.7 32.05,123.28 v25.88,123.28
N$70  (via drill 2)
  Top 2: v4.03,115.8 4.72,115.8 6.53,114 LED1.C
  Bottom 2: v4.03,115.8 6.53,115.8 8.43,117.7 R3.1
N$71
  Bottom 2: K1.P$1 51.92,31.8 49.42,31.8 D3.C
N$80
  Bottom 2: K88.P$1 32.83,12.7 30.12,12.7 D87.C
N$142
  Bottom 2: K122.P$1 252.32,32.7 248.62,32.7 D125.C
RESET  (via drill 2)
  Top 2: R5.2 100.83,114 102.62,115.8 103.83,115.8 S1.2 104.83,115.9 110.33,115.9 S1.1 | v54.58,120.74 59.26,120.74 IC1.1
  Bottom 2: v54.58,120.74 70.48,120.74 75.12,116.1 103.62,116.1 103.83,115.9 S1.2
ROW1  (via drill 2)  (1 unrouted)
  Top 2: v263.62,93.9 262.82,94.7 v245.32,94.7 | v100.88,102.5 98.08,99.7 v91.72,99.7 | v197.13,95.8 206.82,95.8 v207.62,95 207.66,95.04 207.66,107.7 v207.84,107.88
  Bottom 2: v197.13,95.8 195.19,93.85 D99.A | v207.62,95 209.53,95 210.62,93.9 D100.A 211.53,93.9 229.62,93.9 D101.A 229.62,97.92 230.65,98.94 240.62,98.94 245.66,93.9 | 245.66,93.9 245.32,93.9 v245.32,94.7 | 245.66,93.9 248.62,93.9 D102.A | v263.62,93.9 264.02,93.5 267.82,93.5 D103.A | D63.A 30.62,93.9 49.12,93.9 D68.A 51.61,93.85 54.95,97.18 | 86.12,99.5 67.62,99.5 D69.A 67.62,97.1 55.02,97.1 54.95,97.18 | 86.12,99.5 D70.A | 86.12,99.5 91.72,99.5 | 91.72,99.5 94.33,99.5 99.92,93.9 106.12,93.9 D71.A | IC1.23 46.62,107.8 46.62,105.5 54.95,97.18 | v91.72,99.7 91.72,99.5 | v207.84,107.88 205.87,109.86 168.73,109.81 | v100.88,102.5 101.44,103.07 140.16,103.07
ROW2  (via drill 2)  (1 unrouted)
  Top 2: v27.73,96.3 27.23,95.8 27.23,79.15 v27.5,76.72 45.41,76.72 v46.12,76 47.02,75.6 63.42,75.6 v64.12,74.9 | v262.93,75.7 262.52,75.3 226.53,75.3 v225.62,74.9 224.53,76 v207.72,76 207.76,76.03 207.76,88.25 212.76,93.25 212.76,108.86 210.69,110.93 187.47,110.93 180.21,103.66 168.78,103.66 | v102.33,75.78 104.78,78.23 118.86,78.23 122.28,81.65 122.28,86.77 127.7,92.19 127.7,94.76 136.13,94.76 136.13,99.92 139.44,99.92
  Bottom 2: 101.44,74.9 99.55,74.9 96.27,78.18 D75.A 87.61,78.26 71.5,78.26 68.12,74.89 D76.A 67.22,74.9 v64.12,74.9 | 101.44,74.9 106.12,74.9 D74.A | v27.5,76.72 29.32,74.9 31.45,74.9 D78.A | v46.12,76 48.02,76 49.12,74.9 D77.A | IC1.19 36.4,104.83 33.95,102.39 27.73,102.39 v27.73,96.3 | 262.93,74.8 267.62,74.8 D105.A | 262.93,74.8 253.32,74.8 252.93,74.4 248.62,74.4 D106.A | D108.A 210.88,75.98 210.9,76 v207.72,76 207.59,76.14 195.14,76.14 D109.A | v225.62,74.9 226.03,74.5 229.82,74.5 D107.A | v262.93,75.7 262.93,74.8 | 101.44,74.9 v102.33,75.78
ROW3  (via drill 2)  (1 unrouted)
  Top 2: 262.73,56.8 v263.62,55.9 | 262.73,56.8 v245.43,56.8 244.53,56.4 234.93,56.4 233.82,55.3 224.62,55.3 224.43,55.5 207.03,55.5 v206.62,55.9 | v65.59,56.82 65.23,68.79 68.92,72.49 68.92,75.5 | 68.92,75.5 68.92,75.65 77.69,75.65 82.28,71.06 87.69,71.06 97.98,81.36 117.88,81.36 120.01,83.5 120.01,88.18 124.91,93.07 124.91,97.73 133,97.73 133,102.55 139.59,102.55 | IC1.18 33.92,107.8 33.92,104.72 37.86,104.72 40.73,101.86 40.73,94.82 45.12,90.42 45.12,84.37 49.8,79.7 62.38,79.7 66.35,78.35 68.92,75.5 | 262.73,56.8 263.12,57.7 263.12,70.74 266.14,73.76 266.14,77.08 262.26,80.96 225.55,80.96 225.55,91.78 219.12,91.78 219.12,94.3 216.43,94.3 216.43,108.8 211.5,113.72 186.35,113.72 179.12,106.49 168.66,106.49
  Bottom 2: D118.A 191.62,55.9 v206.62,55.9 210.62,55.9 D121.A | 245.43,55.9 248.62,55.9 D123.A | 245.43,55.9 229.62,55.9 D122.A | v263.62,55.9 264.12,55.4 267.62,55.4 D124.A | v245.43,56.8 245.43,55.9 | 87.12,55.9 D92.A | D95.A 106.12,55.9 88.03,55.9 D92.A | IC1.18 33.86,106.28 32.7,105.11 24.93,105.11 24.93,95.5 25.02,95.4 25.02,84.4 24.32,83.7 24.32,74.34 26.66,72 26.66,64.21 30.73,60.15 30.73,57.5 D88.A | D89.A 65.34,56.57 v65.59,56.82 81.34,56.82 D91.A 82.31,55.85 D92.A
ROW4  (via drill 2)  (1 unrouted)
  Top 2: v298.12,29.81 298.12,41.2 265.93,41.2 264.43,39.7 v263.62,39.1 263.02,39.7 209.43,39.7 207.93,38.2 v207.12,37.6 v188.12,37.6 187.72,38.5 187.72,55.3 179.82,55.3 169.12,66 169.12,97.5 | v43.98,36.74 45.13,37.9 45.13,52.23 41.33,56.04 41.33,62.08 45.15,62.08 45.15,70.87 42.7,73.31 40.4,73.31 39.38,73.32 37.56,70.13 29.73,70.13 18.77,81.1 5.62,81.1 5.62,99.4 14.03,107.8 IC1.15 | 139.24,97.02 139.24,83.5 134.33,78.6 130.24,78.6 122.12,70.49 122.12,63.93 115.69,57.5 109.81,57.5 103.12,50.81 v103.12,38
  Bottom 2: v188.12,37.6 188.82,36.9 191.12,36.9 D119.A | v207.12,37.6 210.43,37.6 211.12,36.9 D120.A 211.93,37.5 214.97,40.55 228.03,40.55 229.62,38.96 D126.A | v263.62,39.1 261.93,37.4 248.62,37.4 D125.A | v298.12,29.81 286.66,18.35 D5.A | 103.12,36.9 88.03,36.9 D93.A 87.12,36.8 86.62,36.3 82.03,36.3 81.53,36.8 68.12,36.8 D90.A 65.3,39.67 52.6,39.67 49.33,36.4 | 103.12,36.9 106.12,36.9 D94.A | 45.77,34.94 47.23,36.4 49.33,36.4 | 45.77,34.94 36.44,25.6 29.93,25.6 27.48,23.15 17.84,23.15 12.54,17.85 D82.A | 49.33,36.4 D3.A 49.7,36.8 | 45.77,34.94 v43.98,36.74 | v103.12,38 103.12,36.9
ROW5  (via drill 2)  (1 unrouted)
  Top 2: v197.68,18.53 198.44,19.3 v207.32,19.3 208.22,18.9 235.93,18.9 237.53,17.3 245.72,17.3 246.72,18.3 258.35,18.3 v264.05,24 298.69,24 305.93,31.24 305.93,107.61 299.92,113.63 219.82,113.63 214.29,119.16 183.24,119.16 176.55,112.47 168.85,112.47 | v63.02,19 36.83,19 v36.42,19.4 36.02,18.99 19.23,18.99 2.04,36.17 2.04,100.02 12.5,110.48 31.23,110.48 31.23,107.9 IC1.17 31.32,103.69 34.25,100.77 v37.41,100.77 | v108.04,99.81 113.31,105.08 139.71,105.08
  Route7 2: v37.41,100.77 85.97,100.77 88.77,103.56 93.59,103.56 98.01,99.15 107.38,99.15 v108.04,99.81
  Bottom 2: D113.A 230.12,18.9 239.53,18.9 243.53,22.9 245.72,22.9 249.62,19 D114.A 250.53,19.4 259.14,19.4 263.75,24 v264.05,24 | D111.A 183.77,19.99 196.22,19.99 v197.68,18.53 | v207.32,19.3 210.72,19.3 211.12,18.9 D112.A | v36.42,19.4 33.34,19.4 31.34,17.4 30.12,17.4 D87.A | D83.A v63.02,19 63.83,18.4 68.12,18.4 D84.A D85.A
ROW6  (via drill 2)  (1 unrouted)
  Top 2: v282.62,77.1 v282.62,93.9 | v302,43.15 302,59.48 v302.02,59.5 302.02,72.22 303.36,73.55 303.36,106.33 298.68,111 218.63,111 213.1,116.53 184.75,116.53 177.88,109.66 168.62,109.66 | v5.83,74.5 5.83,67.03 12.59,60.26 12.59,54.04 v8.21,49.66 8.19,49.66 8.19,37.97 v11.43,34.73 | v19.12,105 28.73,105 28.73,107.8 IC1.16
  Route7 2: v19.12,105 111.75,105 arc-90 114.3,102.46 v114.3,99.99
  Bottom 2: D104.A 267.75,18.35 269.54,20.14 269.54,28.92 273.38,36.62 D127.A 277.12,37.65 277.83,38.6 280.63,41.41 284.29,42.66 286.9,40.1 286.8,37.17 290.18,33.79 292.64,33.79 v302,43.15 | 286.62,55.4 D128.A 293.13,58.01 v302.02,59.5 301.71,59.81 303.31,61.41 303.31,81.21 286.73,81.21 v282.62,77.11 v282.62,77.1 282.34,76.81 282.34,74 D4.A | v282.62,93.9 283.82,92.7 D115.A | D80.A 8.59,50.04 v8.21,49.66 | v5.83,74.5 9.12,74.5 10.34,75.72 D79.A 10.34,79.59 6.92,83 6.92,92 D45.A | 6.95,92.42 D45.A | D81.A 13.08,33.07 v11.43,34.73 | D45.A 6.84,92.35 arc-90 9.75,95.26 10.18,95.26 arc90 12.47,97.55 12.61,99.54 arc-90 14.58,101.5 16.59,101.5 arc90 19.12,104.04 v19.12,105 | 140.25,100.37 114.67,100.37 v114.3,99.99
ROW7  (via drill 2)  (1 unrouted)
  Top 2: v121.12,19.4 v121.12,36.9 122.03,37.3 126.58,41.86 135.81,41.86 140.32,46.38 v140.32,55.5 | IC1.24 49.1,104.81 51.34,102.58 84.14,102.58 90.01,96.7 v93.22,96.7 93.36,96.83 100.03,96.83 110.86,107.67 139.62,107.67
  Bottom 2: D98.A 169.72,42.14 169.72,53.5 D110.A 169.72,54.4 169.72,72.5 D117.A 169.72,73.4 169.72,91.5 D116.A 169.54,91.73 169.54,98.08 | v121.12,36.9 124.62,36.9 D97.A | 134.72,61.1 139.03,65.4 139.03,70.3 131.53,77.8 125.62,77.8 D73.A 125.12,78.7 122.22,81.6 122.22,81.8 | 134.72,61.1 129.53,55.9 125.12,55.9 D96.A | 122.22,81.8 122.22,86.6 123.83,88.2 D72.A | v93.22,96.7 103.22,86.7 103.22,84.4 105.83,81.8 122.22,81.8 | 134.72,61.1 v140.32,55.5 | K97.P$2 126.38,16.13 123.11,19.4 v121.12,19.4
VCC  (via drill 2)  (6 unrouted)
  Top 0.152: U1.VBUS1 98.02,121.94 98.02,115.5 98.02,114.83 R5.1 98.73,113.89
  Top 2: R2.1 93.61,112.14 | 130.62,124.04 116.28,124.04 | R2.1 96.81,112.16 98.54,113.89 98.02,114.42 98.02,115.5 | IC1.7 44.02,114 38.94,108.92 IC1.20 IC1.21 41.48,105.69 47.45,99.72 81.12,99.72 v81.12,96.8 | v66.88,114.69 70.19,114.69 77,112.52 90.35,112.52 R2.1 | U1.VBUS1 100.75,121.99 103.97,123.73 104.09,123.86 109.44,123.86 114.62,123.78
  Route7 2: v66.88,114.69 75.81,105.77 105.9,105.77 110.74,100.93 110.74,98.69 105.77,93.72 84.39,93.72 81.31,96.8 v81.12,96.8
(copper drawn outside any net)
  shapes: Top area x2